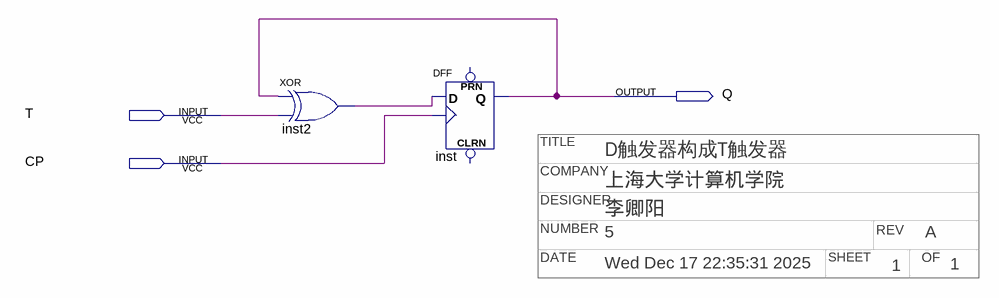
[diagram p0: schematic sheet]
// Quartus schematic sikao2.bdf as structural Verilog: 2 symbols, 3 pins
// Title block: TITLE: D触发器构成T触发器; COMPANY: 上海大学计算机学院; DESIGNER: 李卿阳; NUMBER: 5; REV: A; DATE: Wed Dec 17 22:35:31 2025; SHEET: 1; OF: 1
module sikao2 (
  input  T,
  input  CP,
  output Q
);

  wire inst2_out;

  xor inst2 (inst2_out, Q, T);
  DFF inst (.CLK(CP), .D(inst2_out), .Q(Q));  // open: CLRN, PRN
endmodule
